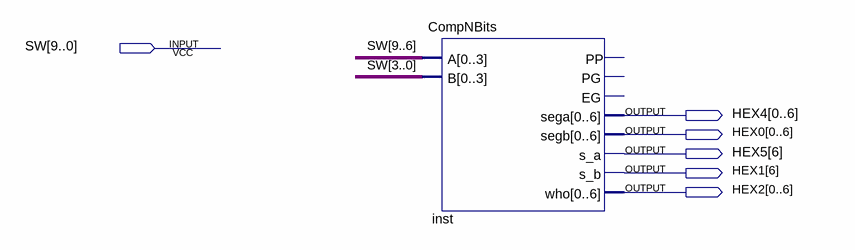
[diagram p0: schematic sheet]
// Quartus schematic intergrationCompNBits.bdf as structural Verilog: 1 symbols, 6 pins
module intergrationCompNBits (
  input  [9:0] SW,
  output [0:6] HEX4,
  output [0:6] HEX0,
  output [6:6] HEX5,
  output [6:6] HEX1,
  output [0:6] HEX2
);

  CompNBits inst (
    .A(SW[9:6]), .B(SW[3:0]), .sega(HEX4), .segb(HEX0), .s_a(HEX5[6]), .s_b(HEX1[6]), .who(HEX2));  // open: PP, PG, EG
endmodule
